# Altium schematic sheet LCD_NOKIA1616.SchDoc
size 203 x 139 mm
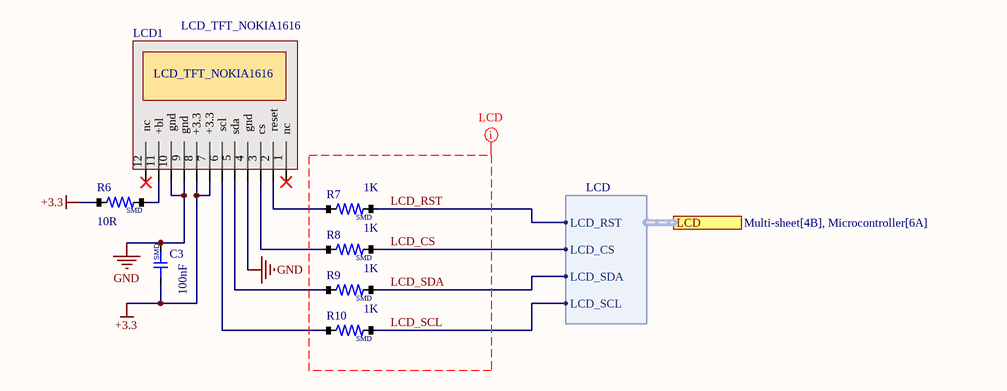
[diagram p0: LCD_NOKIA1616.SchDoc]

## Parts
C3  100nF  [CAP-0805]
LCD1  LCD_TFT_NOKIA1616  [lcd1616-flat]
R6  10R  [RES/0805]
R7  1K  [RES/0805]
R8  1K  [RES/0805]
R9  1K  [RES/0805]
R10  1K  [RES/0805]

## Ports
LCD (harness LCD, see Multi-sheet[4B], Microcontroller[6A])

## Harnesses
LCD: LCD_RST, LCD_CS, LCD_SDA, LCD_SCL

## Nets
+3.3: C3.1 LCD1.7(+3.3) LCD1.8(+3.3) R6.1
GND: C3.2 LCD1.4(gnd) LCD1.9(gnd) LCD1.10(gnd)
LCD_CS: R8.2 ; port LCD.LCD_CS
LCD_RST: R7.2 ; port LCD.LCD_RST
LCD_SCL: R10.2 ; port LCD.LCD_SCL
LCD_SDA: R9.2 ; port LCD.LCD_SDA
NetLCD1_2: LCD1.2(reset) R7.1
NetLCD1_3: LCD1.3(cs) R8.1
NetLCD1_5: LCD1.5(sda) R9.1
NetLCD1_6: LCD1.6(scl) R10.1
NetLCD1_11: LCD1.11(+bl) R6.2

Not connected (* = marked no-connect by the designer): LCD1 1(nc)* 12(_nc)*

## Layout directives
net class LCD: LCD_CS, LCD_RST, LCD_SCL, LCD_SDA

## Notes on the sheet
- (in symbol cap_smd) SMD
- (in symbol RES/SMD) SMD

## Library data of the parts
C3 = cap_smd
LCD1 = lcd_nokia1616
R6-R10 = RES/SMD